# Altium schematic sheet 1_BLE-T3_top.SchDoc: waffling60 - PCB
size A4; Engineer: 4pplet; Revision: RevA; ProjectName: waffling60
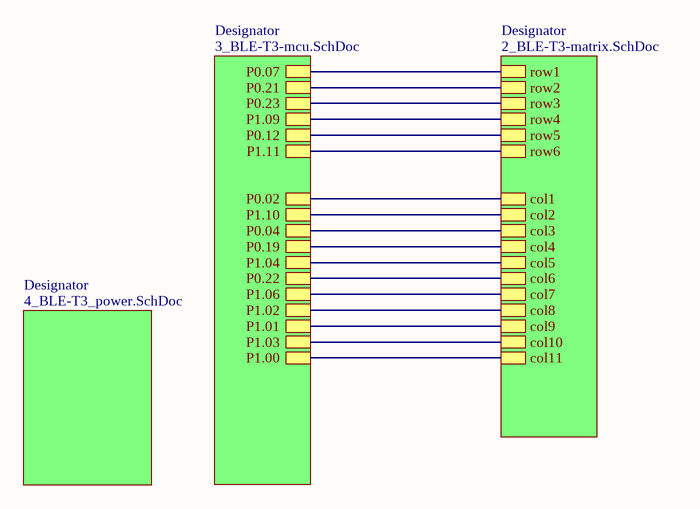
[diagram p0: 1_BLE-T3_top.SchDoc]

## Sub-sheets
Designator = 3_BLE-T3-mcu.SchDoc: P1.02, P1.04, P1.06, P0.12, P1.09, P1.11, P0.04, P1.10, P0.07, P0.02, P0.21, P0.23, P1.03, P1.00, P1.01, P0.22, P0.19
Designator = 2_BLE-T3-matrix.SchDoc: col6, col8, col5, col7, col3, col2, col1, col4, col9, row3, row1, row4, row2, row5, col11, col10, row6
Designator = 4_BLE-T3_power.SchDoc: no entries

## Nets
(unnamed): sheet Designator/P1.02, sheet Designator/col8
(unnamed): sheet Designator/P1.04, sheet Designator/col5
(unnamed): sheet Designator/P1.06, sheet Designator/col7
(unnamed): sheet Designator/P0.12, sheet Designator/row5
(unnamed): sheet Designator/P1.09, sheet Designator/row4
(unnamed): sheet Designator/P1.11, sheet Designator/row6
(unnamed): sheet Designator/P0.04, sheet Designator/col3
(unnamed): sheet Designator/P1.10, sheet Designator/col2
(unnamed): sheet Designator/P0.07, sheet Designator/row1
(unnamed): sheet Designator/P0.02, sheet Designator/col1
(unnamed): sheet Designator/P0.21, sheet Designator/row2
(unnamed): sheet Designator/P0.23, sheet Designator/row3
(unnamed): sheet Designator/P1.03, sheet Designator/col10
(unnamed): sheet Designator/P1.00, sheet Designator/col11
(unnamed): sheet Designator/P1.01, sheet Designator/col9
(unnamed): sheet Designator/P0.22, sheet Designator/col6
(unnamed): sheet Designator/P0.19, sheet Designator/col4